# Altium schematic sheet 09) USB.SchDoc
size 447 x 332 mm
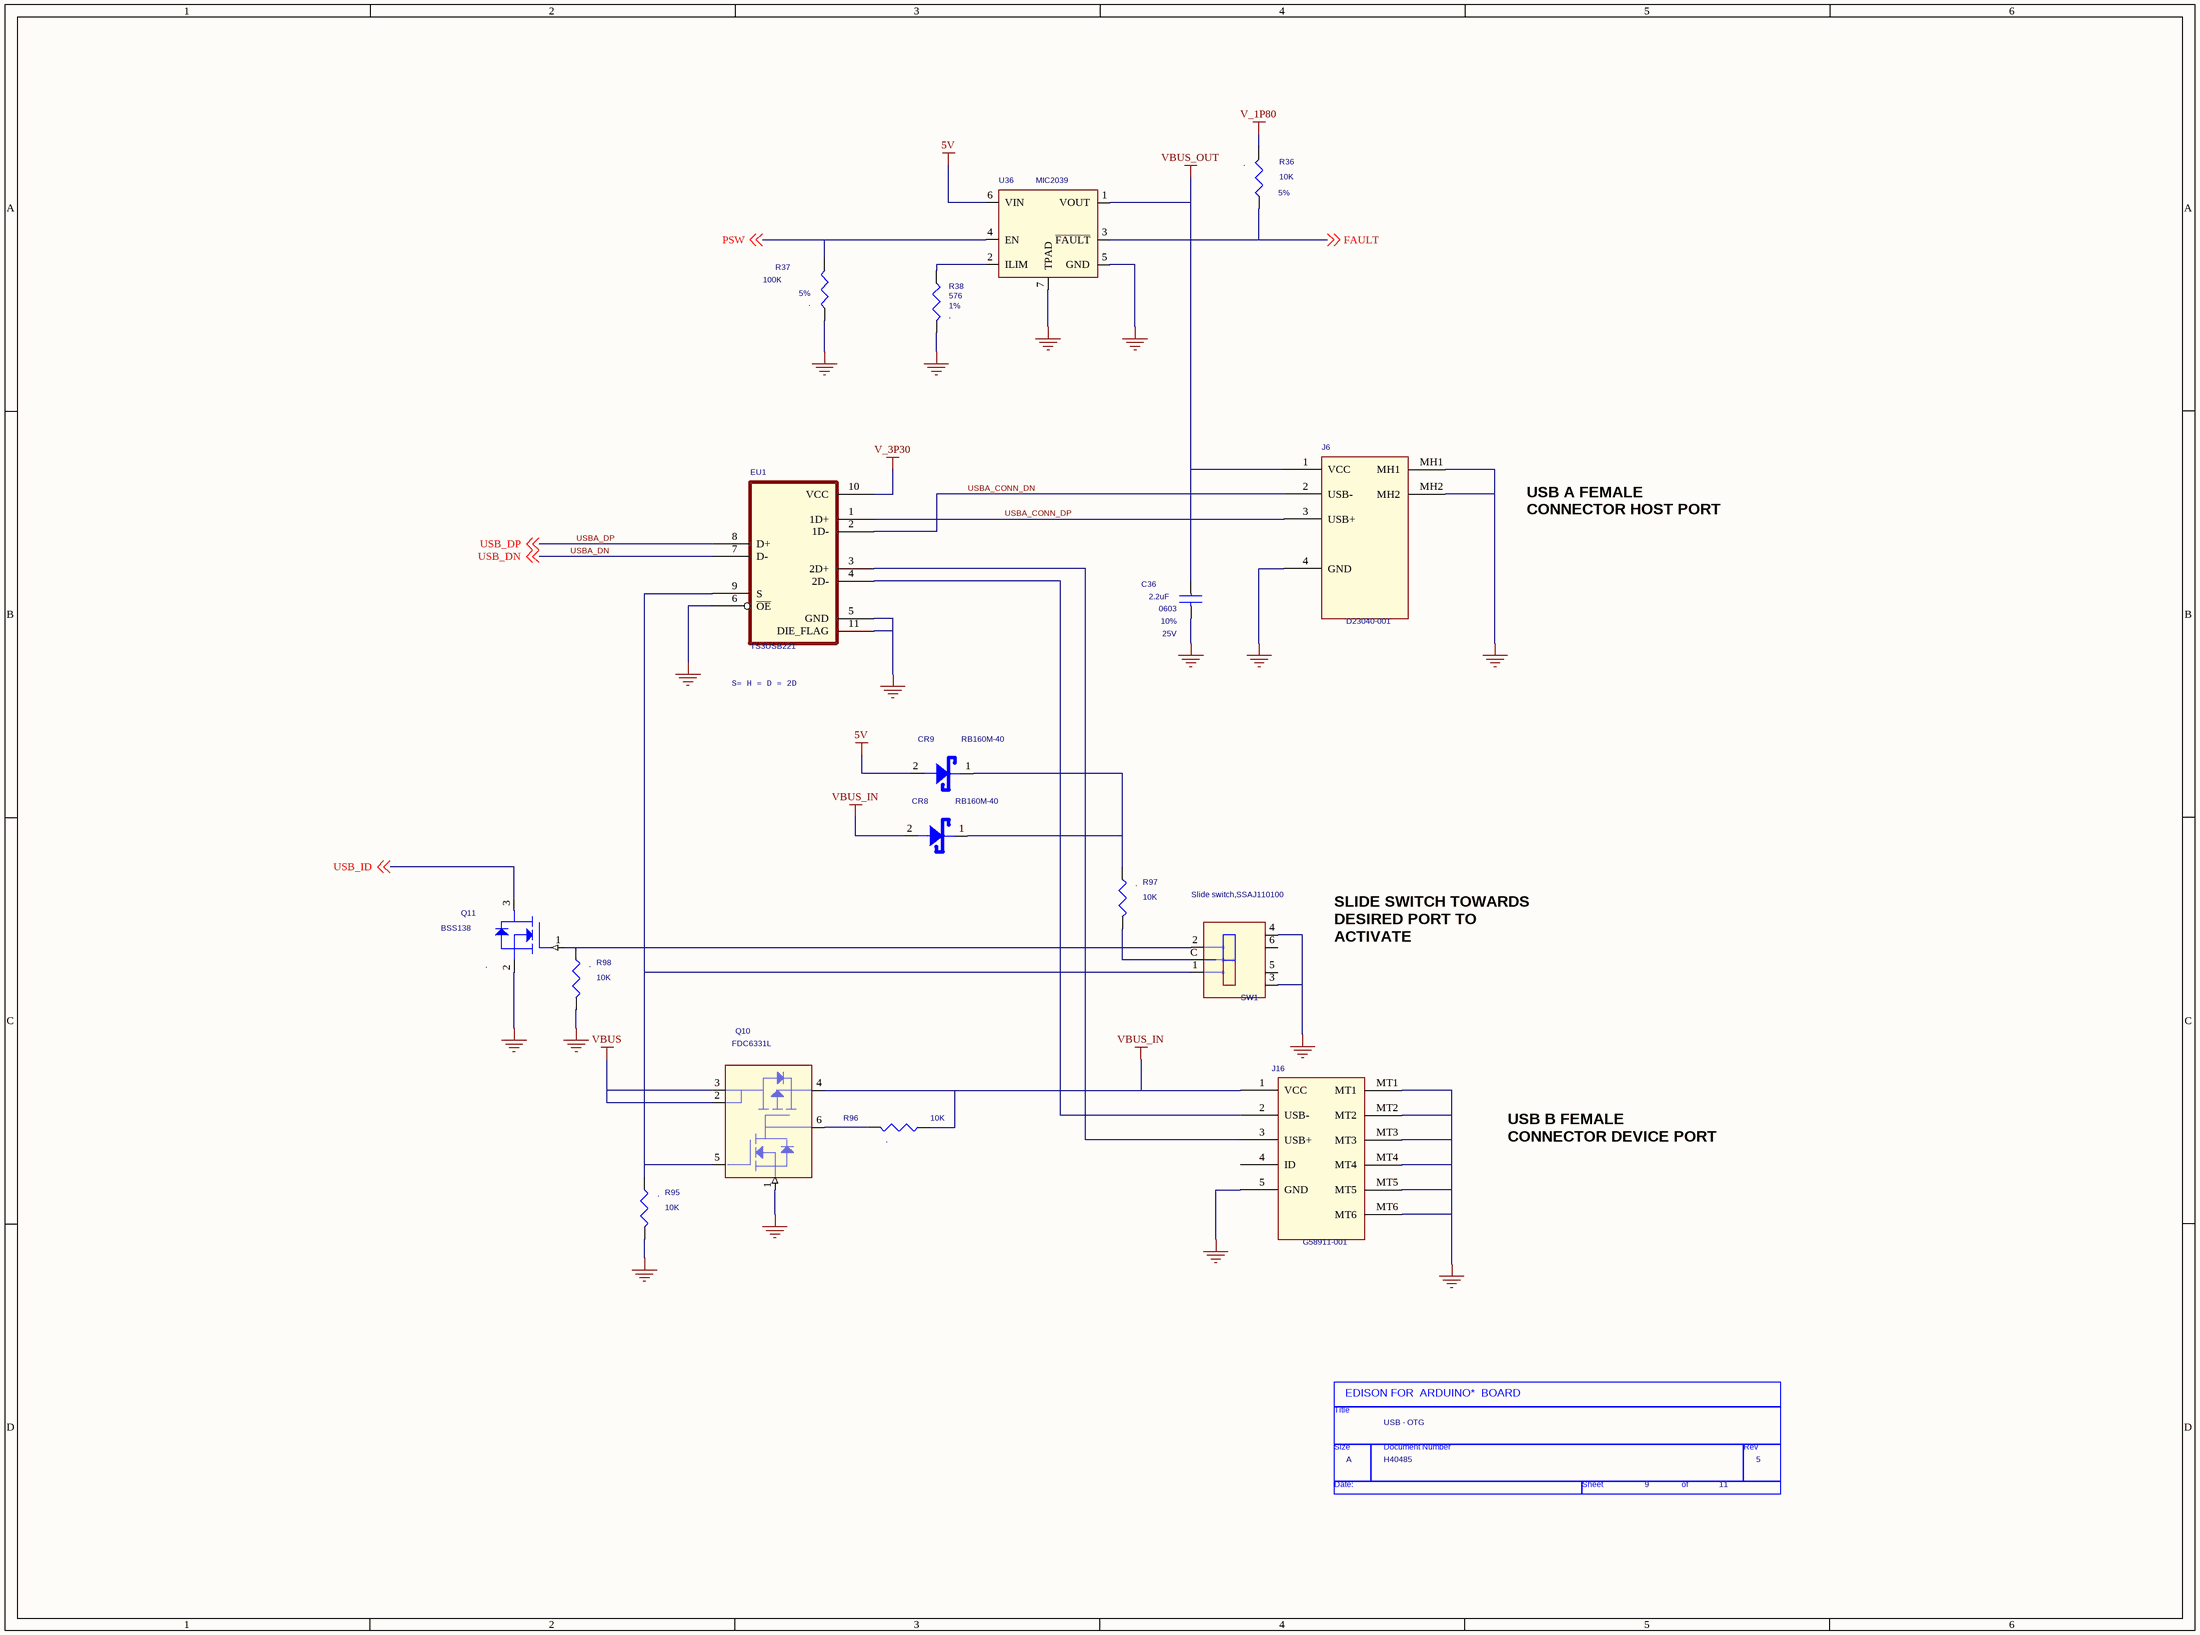
[diagram p0: 09) USB.SchDoc]

## Parts
*  Page Count: 11  Page Number: 9  Page Size: A  Title: USB - OTG  RevCode: 5  Doc: H40485  (hidden comment: TitleBlock0)  (graphical)
C36  2.2uF  TOL: 10%  SIZE: 0603  RATING: 25V  [SMC0603_hi_value]
CR8  RB160M-40  [SOD123_67x106]
CR9  RB160M-40  [SOD123_67x106]
EU1  TS3USB221  [LCC10_P5MM_EP65X94]
J6  D23040-001  [RCPT_USB_5P_DIP_SM]
J16  G58911-001  [RCPT_USB_5P_DIP_SM]
Q10  FDC6331L  [SSOT-6]
Q11  BSS138  NO_STUFF: .  [SOT23]
R36  10K  NO_STUFF: .  TOL: 5%  [SMR0201]
R37  100K  NO_STUFF: .  TOL: 5%  [SMR0201]
R38  576  NO_STUFF: .  TOL: 1%  [SMR0201]
R95  10K  NO_STUFF: .  [SMR0201]
R96  10K  NO_STUFF: .  [SMR0201]
R97  10K  NO_STUFF: .  [SMR0201]
R98  10K  NO_STUFF: .  [SMR0201]
SW1  Slide switch,SSAJ110100  [sw_ssaj110100_3p]
U36  MIC2039  [DFN_6P_2X2MM]

## Nets
5V: CR9.2(Anode) U36.6(VIN)
GND: C36.2 EU1.5(GND) EU1.6(~{OE}) EU1.11(DIE_FLAG) J6.4(GND) J6.MH1 J6.MH2 J16.5(GND) J16.MT1 J16.MT2 J16.MT3 J16.MT4 J16.MT5 J16.MT6 Q10.1(R2) Q11.2(S) R37.2 R38.2 R95.1 R98.1 SW1.3(MT_1) SW1.4(MT_2) U36.5(GND) U36.7(TPAD)
V_1P80: R36.2
V_3P30: EU1.10(VCC)
VBUS: Q10.2(VOUT2) Q10.3(VOUT1)
VBUS_IN: CR8.2(Anode) J16.1(VCC) Q10.4(VOUT) R96.1
VBUS_OUT: C36.1 J6.1(VCC) U36.1(VOUT)
FAULT: R36.1 U36.3(~{FAULT}) ; off-sheet FAULT
PSW: R37.1 U36.4(EN) ; off-sheet PSW
USB_ID: Q11.3(D) ; off-sheet USB_ID
USBA_CONN_DN: EU1.2(1D-) J6.2(USB-)
USBA_CONN_DP: EU1.1(1D+) J6.3(USB+)
USBA_DN: EU1.7(D-) ; off-sheet USB_DN  [also labelled USB_DN]
USBA_DP: EU1.8(D+) ; off-sheet USB_DP  [also labelled USB_DP]
NetCR8_1: CR8.1(Cathode) CR9.1(Cathode) R97.2
NetEU1_3: EU1.3(2D+) J16.3(USB+)
NetEU1_4: EU1.4(2D-) J16.2(USB-)
NetEU1_9: EU1.9(S) Q10.5(ON) R95.2 SW1.1
NetQ10_6: Q10.6(R1C1) R96.2
NetQ11_1: Q11.1(G) R98.2 SW1.2
NetR38_1: R38.1 U36.2(ILIM)
NetR97_1: R97.1 SW1.C

Not connected (* = marked no-connect by the designer): J16 4(ID); SW1 5(MT_3) 6(MT_4)

## Notes on the sheet
- USB A FEMALE
  CONNECTOR HOST PORT
- S= H = D = 2D
- SLIDE SWITCH TOWARDS
  DESIRED PORT TO
  ACTIVATE
- USB B FEMALE
  CONNECTOR DEVICE PORT
- (in symbol TitleBlock0) EDISON FOR  ARDUINO*  BOARD; Title; Size; Document Number; Rev; Date:; Sheet; of

## Library data of the parts
C36 = CAPC,X5R,0603,25V,10%,2.2uF: CAPC,X5R,0603,2.2UF,25.00V,+/- 10%; PART_NUMBER: 602433-091; FINANCE: x; LEAD_FREE: YES; NO_STUFF: .; ROOM: USB; BOM: x; DEVICE: 602433-091; IPN: 602433-091
CR8 CR9 = DIO,SHTKY,SOD123,RB160M-40: DIODE SHKY 1A 40V SOD123; Manufacturer P/N: RM160M-40; Manufacturer: Pillips; FINANCE: x; LEAD_FREE: YES; IPN: E58800-001; NO_STUFF: .; Device: E58800-001; BOM: x; PART_NUMBER: E58800-001
EU1 = IC,TS3USB221,SON10,MPlex_0: IC,LIN,ANALOGSWITCH,SON,TS3USB22,; PART_NUMBER: G67765-001; NO_STUFF: .; LEAD_FREE: YES; BOM: x; ROOM: NO_ROOM; DEVICE: G67765-001; IPN: G67765-001; FINANCE: x
J6 = CON4,USB,RA,_4: CONN,MISC,5P,MICRO USB,B TYPE,RECEPT,2013499-1; BOM: x; LEAD_FREE: YES; NO_STUFF: .; FINANCE: x; IPN: D23040-001; DEVICE: D23040-001; PART_NUMBER: D23040-001
J16 = CON4,USB,RA,_1: CONN,MISC,5P,MICRO USB,B TYPE,RECEPT,2013499-1; BOM: x; LEAD_FREE: YES; NO_STUFF: .; FINANCE: x; IPN: G58911-001; DEVICE: G58911-001; PART_NUMBER: G58911-001
Q10 = IC,FDC6331,LOADSWI: C,FDC6331L,LOAD_SWITCH,2.8A; PART_NUMBER: G79283-001; NO_STUFF: .; LEAD_FREE: YES; BOM: x; IPN: G79283-001; Device: fdc6331; FINANCE: x; PART NUMBER: G79283-001
Q11 = XSTR,BSS138,FET,NCH,SOT23: IC,DS,FET N,SOT-23,BSS138LT3G; FINANCE: x; LEAD_FREE: YES; Device: C81974-001; BOM: x; IPN: C81974-001; PART_NUMBER: C81974-001
R36 = RESD,0201,5%,1/20W,10K: RES D,0201,10.00 kOHM,5.00%,1/20W,YES; Device: C80792-002; BOM: x; ROOM: AUDIO_CODEC; RATING: 1/20W; IPN: C80792-002; PART_NUMBER: C80792-002; LEAD_FREE: YES; FINANCE: x
R37 = RESD,0201,5%,1/20W,100K: RES D,0201,100.00 kOHM,5.00%,1/20W,YES; Device: C80792-011; BOM: x; ROOM: APE_PMIC_MISC; RATING: 1/20W; IPN: C80792-011; PART_NUMBER: C80792-011; LEAD_FREE: YES; FINANCE: x
R38 = RESD,0201,1%,1/20W,562: RES D,0402,576.00 OHM,1.00%,1/16W,YES; PART_NUMBER: A93548-403; RATING: 1/20W; BOM: x; LEAD_FREE: YES; FINANCE: x
R95-R98 = RESD,0201,5%,1/20W,10K: RES D,0201,10.00 kOHM,5.00%,1/20W,YES; Device: C80792-002; TOL: 5%; BOM: x; ROOM: AUDIO_CODEC; RATING: 1/20W; IPN: C80792-002; PART_NUMBER: C80792-002; LEAD_FREE: YES; FINANCE: x
SW1 = SWCH,Slide,SPST,SMT,SSAJ110100: Part_Number: G99612-001; MFR: ALPS; FINANCE: x; LEAD_FREE: YES; ROOM: NO_ROOM; BOM: x; Device: G99612-001; IPN: G99612-001; MFR P/N: SSAJ110100
U36 = IC,MIC2039,UsbPwrSwtch_0: IC,LIN,ANALOGSWITCH,DFN,MIC2039,; PART_NUMBER: H40907-001; MFG P/N: MIC2039EYMT; MFG: MICREL; FINANCE: x; LEAD_FREE: YES; NO_STUFF: .; IPN: G11660-001; ROOM: NO_ROOM; BOM: x
* = TitleBlock0: Page Create Date: March  8, 1995